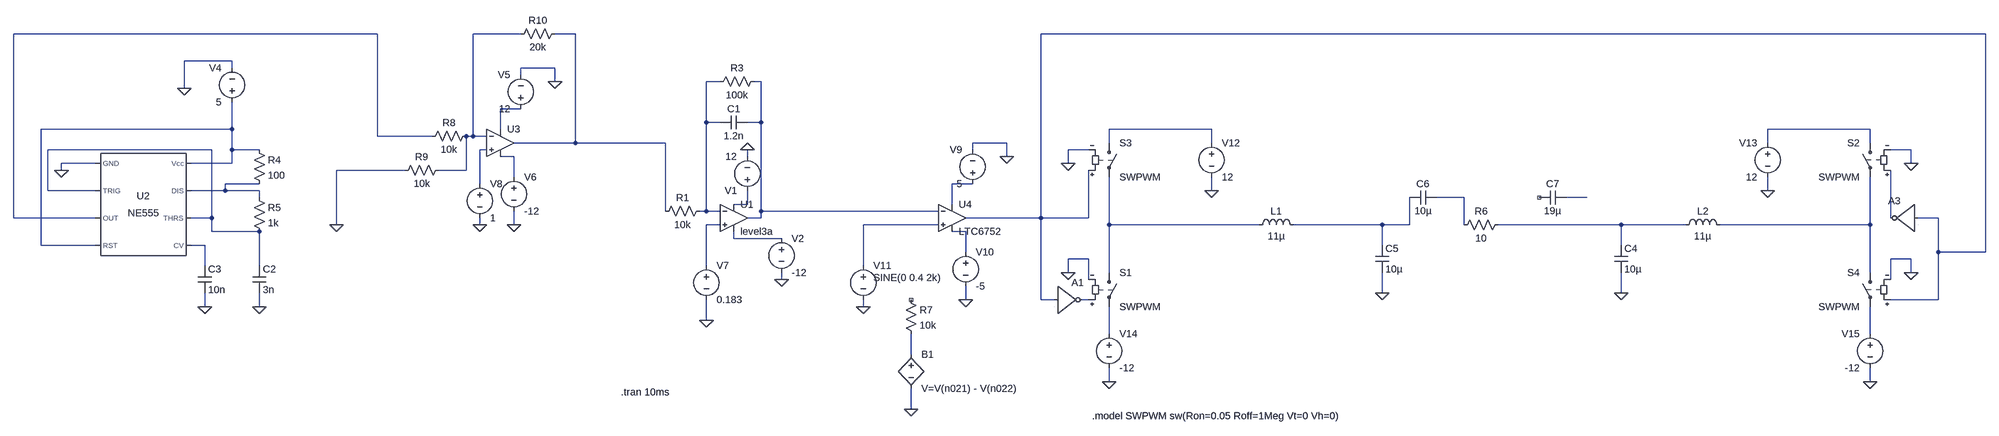
[diagram p0: schematic class_D_amp.asc]
class_D_amp.asc, the LTspice schematic file:
Version 4.1
SHEET 1 4280 724
WIRE -880 -256 -1936 -256
WIRE -544 -256 -656 -256
WIRE -416 -256 -464 -256
WIRE 3424 -256 1088 -256
WIRE -1424 -192 -1536 -192
WIRE -1424 -176 -1424 -192
WIRE -464 -176 -544 -176
WIRE -544 -160 -544 -176
WIRE -464 -144 -464 -176
WIRE 288 -144 256 -144
WIRE 384 -144 368 -144
WIRE -1536 -128 -1536 -192
WIRE -544 -80 -592 -80
WIRE 256 -48 256 -144
WIRE 288 -48 256 -48
WIRE 384 -48 384 -144
WIRE 384 -48 352 -48
WIRE -1424 -32 -1424 -96
WIRE -1424 -32 -1872 -32
WIRE -592 -32 -592 -80
WIRE 1488 -32 1248 -32
WIRE 3040 -32 2800 -32
WIRE -880 -16 -880 -256
WIRE -752 -16 -880 -16
WIRE -656 -16 -656 -256
WIRE -656 -16 -672 -16
WIRE -624 -16 -656 -16
WIRE -416 0 -416 -256
WIRE -416 0 -560 0
WIRE 160 0 -416 0
WIRE 1008 0 928 0
WIRE 1248 0 1248 -32
WIRE 1488 0 1488 -32
WIRE 2800 0 2800 -32
WIRE 3040 0 3040 -32
WIRE -1472 16 -1856 16
WIRE -1424 16 -1424 -32
WIRE -1360 16 -1424 16
WIRE -624 16 -640 16
WIRE 928 16 928 0
WIRE 1200 16 1152 16
WIRE 3136 16 3088 16
WIRE -560 32 -592 32
WIRE 352 32 352 16
WIRE 1008 32 1008 0
WIRE -1744 48 -1824 48
WIRE -1424 48 -1424 16
WIRE -1424 48 -1520 48
WIRE 1152 48 1152 16
WIRE 3136 48 3136 16
WIRE -1824 64 -1824 48
WIRE -816 64 -976 64
WIRE -672 64 -672 -16
WIRE -672 64 -736 64
WIRE -560 80 -560 32
WIRE -1360 96 -1440 96
WIRE -640 96 -640 16
WIRE 928 96 880 96
WIRE -1856 112 -1856 16
WIRE -1744 112 -1856 112
WIRE -1440 112 -1440 96
WIRE -1440 112 -1520 112
WIRE -1360 112 -1440 112
WIRE 1488 112 1488 80
WIRE 2800 112 2800 80
WIRE -1360 128 -1360 112
WIRE 2080 128 2016 128
WIRE 2368 128 2320 128
WIRE 352 144 352 112
WIRE 352 144 320 144
WIRE 880 144 880 96
WIRE 160 160 160 0
WIRE 256 160 256 -48
WIRE 256 160 240 160
WIRE 288 160 256 160
WIRE 384 160 384 -48
WIRE 848 160 384 160
WIRE -1936 176 -1936 -256
WIRE -1744 176 -1936 176
WIRE -1472 176 -1472 16
WIRE -1472 176 -1520 176
WIRE 384 176 384 160
WIRE 384 176 352 176
WIRE 1088 176 1088 -256
WIRE 1088 176 912 176
WIRE 1200 176 1200 64
WIRE 1200 176 1088 176
WIRE 3088 176 3088 64
WIRE 3200 176 3152 176
WIRE -976 192 -976 64
WIRE -640 192 -640 176
WIRE -560 192 -560 160
WIRE 288 192 256 192
WIRE 848 192 672 192
WIRE 1248 192 1248 80
WIRE 1600 192 1248 192
WIRE 1888 192 1680 192
WIRE 1952 192 1952 128
WIRE 1952 192 1888 192
WIRE 2080 192 2080 128
WIRE 2448 192 2160 192
WIRE 2608 192 2448 192
WIRE 3040 192 3040 80
WIRE 3040 192 2688 192
WIRE -1472 208 -1472 176
WIRE -1360 208 -1472 208
WIRE 912 208 880 208
WIRE 320 224 320 208
WIRE 432 224 320 224
WIRE -1872 240 -1872 -32
WIRE -1744 240 -1872 240
WIRE -1488 240 -1520 240
WIRE 1888 240 1888 192
WIRE 2448 240 2448 192
WIRE 912 256 912 208
WIRE 3200 256 3200 176
WIRE 3424 256 3424 -256
WIRE 3424 256 3200 256
WIRE 1200 272 1152 272
WIRE 3136 272 3088 272
WIRE -1488 288 -1488 240
WIRE -1360 288 -1360 208
WIRE 256 288 256 192
WIRE 672 288 672 192
WIRE 1152 304 1152 272
WIRE 1248 304 1248 192
WIRE 3040 304 3040 192
WIRE 3136 304 3136 272
WIRE 432 320 432 304
WIRE 1200 320 1200 272
WIRE 3088 320 3088 272
WIRE 1888 352 1888 304
WIRE 2448 352 2448 304
WIRE 912 368 912 336
WIRE 1088 368 1088 176
WIRE 1120 368 1088 368
WIRE 1200 368 1184 368
WIRE 3200 368 3200 256
WIRE 3200 368 3088 368
WIRE -1488 384 -1488 352
WIRE -1360 384 -1360 352
WIRE 672 384 672 368
WIRE 256 416 256 368
WIRE 1248 448 1248 384
WIRE 3040 448 3040 384
WIRE 784 496 784 448
WIRE 1248 560 1248 528
WIRE 3040 560 3040 528
WIRE 784 624 784 576
FLAG 352 16 0
FLAG 432 320 0
FLAG 256 416 0
FLAG -1536 -128 0
FLAG -1824 64 0
FLAG -1488 384 0
FLAG -1360 384 0
FLAG -560 192 0
FLAG -464 -144 0
FLAG -976 192 0
FLAG -640 192 0
FLAG 912 368 0
FLAG 1008 32 0
FLAG 672 384 0
FLAG 1152 48 0
FLAG 1152 304 0
FLAG 1248 560 0
FLAG 1488 112 0
FLAG 3136 48 0
FLAG 3136 304 0
FLAG 3040 560 0
FLAG 2800 112 0
FLAG 784 624 0
FLAG 1888 352 0
FLAG 2448 352 0
SYMBOL OpAmps\\UniversalOpAmp3 320 176 R0
SYMATTR InstName U1
SYMBOL voltage 352 128 R180
WINDOW 123 0 0 Left 0
WINDOW 39 0 0 Left 0
SYMATTR InstName V1
SYMATTR Value 12
SYMBOL voltage 432 208 R0
WINDOW 123 0 0 Left 0
WINDOW 39 0 0 Left 0
SYMATTR InstName V2
SYMATTR Value -12
SYMBOL res 256 144 R90
WINDOW 0 0 56 VBottom 2
WINDOW 3 32 56 VTop 2
SYMATTR InstName R1
SYMATTR Value 10k
SYMBOL cap 352 -64 R90
WINDOW 0 0 32 VBottom 2
WINDOW 3 32 32 VTop 2
SYMATTR InstName C1
SYMATTR Value 1.2n
SYMBOL res 384 -160 R90
WINDOW 0 0 56 VBottom 2
WINDOW 3 32 56 VTop 2
SYMATTR InstName R3
SYMATTR Value 100k
SYMBOL Misc\\NE555 -1632 144 R0
SYMATTR InstName U2
SYMBOL voltage -1424 -80 R180
WINDOW 0 24 96 Left 2
WINDOW 3 24 16 Left 2
WINDOW 123 0 0 Left 0
WINDOW 39 0 0 Left 0
SYMATTR InstName V4
SYMATTR Value 5
SYMBOL res -1376 0 R0
SYMATTR InstName R4
SYMATTR Value 100
SYMBOL res -1376 112 R0
SYMATTR InstName R5
SYMATTR Value 1k
SYMBOL cap -1376 288 R0
SYMATTR InstName C2
SYMATTR Value 3n
SYMBOL cap -1504 288 R0
SYMATTR InstName C3
SYMATTR Value 10n
SYMBOL res -448 -272 R90
WINDOW 0 0 56 VBottom 2
WINDOW 3 32 56 VTop 2
SYMATTR InstName R10
SYMATTR Value 20k
SYMBOL voltage -544 -64 R180
WINDOW 0 24 96 Left 2
WINDOW 3 24 16 Left 2
WINDOW 123 0 0 Left 0
WINDOW 39 0 0 Left 0
SYMATTR InstName V5
SYMATTR Value 12
SYMBOL voltage -560 64 R0
WINDOW 123 0 0 Left 0
WINDOW 39 0 0 Left 0
SYMATTR InstName V6
SYMATTR Value -12
SYMBOL res -656 -32 R90
WINDOW 0 0 56 VBottom 2
WINDOW 3 32 56 VTop 2
SYMATTR InstName R8
SYMATTR Value 10k
SYMBOL res -720 48 R90
WINDOW 0 0 56 VBottom 2
WINDOW 3 32 56 VTop 2
SYMATTR InstName R9
SYMATTR Value 10k
SYMBOL voltage -640 80 R0
WINDOW 123 0 0 Left 0
WINDOW 39 0 0 Left 0
SYMATTR InstName V8
SYMATTR Value 1
SYMBOL OpAmps\\UniversalOpAmp -592 0 R0
SYMATTR InstName U3
SYMBOL voltage 256 272 R0
WINDOW 123 0 0 Left 0
WINDOW 39 0 0 Left 0
SYMATTR InstName V7
SYMATTR Value 0.183
SYMBOL voltage 928 112 R180
WINDOW 0 24 96 Left 2
WINDOW 3 24 16 Left 2
WINDOW 123 0 0 Left 0
WINDOW 39 0 0 Left 0
SYMATTR InstName V9
SYMATTR Value 5
SYMBOL voltage 912 240 R0
WINDOW 123 0 0 Left 0
WINDOW 39 0 0 Left 0
SYMATTR InstName V10
SYMATTR Value -5
SYMBOL voltage 672 272 R0
WINDOW 123 0 0 Left 0
WINDOW 39 0 0 Left 0
WINDOW 3 24 44 Left 2
SYMATTR Value SINE(0 0.4 2k)
SYMATTR InstName V11
SYMBOL Comparators\\LTC6752 880 112 R0
SYMATTR InstName U4
SYMBOL sw 1248 -16 R0
SYMATTR InstName S3
SYMATTR Value SWPWM
SYMBOL sw 1248 288 R0
SYMATTR InstName S1
SYMATTR Value SWPWM
SYMBOL Digital\\inv 1120 304 R0
SYMATTR InstName A1
SYMBOL voltage 1488 -16 R0
WINDOW 123 0 0 Left 0
WINDOW 39 0 0 Left 0
SYMATTR InstName V12
SYMATTR Value 12
SYMBOL voltage 1248 432 R0
WINDOW 123 0 0 Left 0
WINDOW 39 0 0 Left 0
SYMATTR InstName V14
SYMATTR Value -12
SYMBOL ind 1584 208 R270
WINDOW 0 32 56 VTop 2
WINDOW 3 5 56 VBottom 2
SYMATTR InstName L1
SYMATTR Value 11µ
SYMATTR SpiceLine Rser=1m
SYMBOL sw 3040 -16 M0
SYMATTR InstName S2
SYMATTR Value SWPWM
SYMBOL sw 3040 288 M0
SYMATTR InstName S4
SYMATTR Value SWPWM
SYMBOL voltage 2800 -16 M0
WINDOW 123 0 0 Left 0
WINDOW 39 0 0 Left 0
SYMATTR InstName V13
SYMATTR Value 12
SYMBOL voltage 3040 432 M0
WINDOW 123 0 0 Left 0
WINDOW 39 0 0 Left 0
SYMATTR InstName V15
SYMATTR Value -12
SYMBOL ind 2704 208 M270
WINDOW 0 32 56 VTop 2
WINDOW 3 5 56 VBottom 2
SYMATTR InstName L2
SYMATTR Value 11µ
SYMATTR SpiceLine Rser=1m
SYMBOL Digital\\inv 3152 112 M0
SYMATTR InstName A3
SYMBOL bv 784 480 R0
SYMATTR InstName B1
SYMATTR Value V=V(n021) - V(n022)
SYMBOL res 768 352 R0
SYMATTR InstName R7
SYMATTR Value 10k
SYMBOL res 2176 176 R90
WINDOW 0 0 56 VBottom 2
WINDOW 3 32 56 VTop 2
SYMATTR InstName R6
SYMATTR Value 10
SYMBOL cap 2432 240 R0
SYMATTR InstName C4
SYMATTR Value 10µ
SYMBOL cap 1872 240 R0
SYMATTR InstName C5
SYMATTR Value 10µ
SYMBOL cap 2016 112 R90
WINDOW 0 0 32 VBottom 2
WINDOW 3 32 32 VTop 2
SYMATTR InstName C6
SYMATTR Value 10µ
SYMBOL cap 2320 112 R90
WINDOW 0 0 32 VBottom 2
WINDOW 3 32 32 VTop 2
SYMATTR InstName C7
SYMATTR Value 19µ
TEXT 56 584 Left 2 !.tran 10ms
TEXT 1208 640 Left 2 !.model SWPWM sw(Ron=0.05 Roff=1Meg Vt=0 Vh=0)

The netlist it stands for:
* class_D_amp.asc
X§U1 N020 N005 N018 N027 N006 level3a  ; pins In+ In- V+ V- OUT
V1 N018 0 12
V2 N027 0 -12
R1 N005 N003 10k
C1 N006 N005 1.2n
R3 N006 N005 100k
X§U2 0 N011 N001 N008 N028 N011 N014 N008 NE555  ; pins GND TRIG OUT RST CV THRS DIS Vcc
V4 N008 0 5
R4 N008 N014 100
R5 N014 N011 1k
C2 N011 0 3n
C3 N028 0 10n
R10 N003 N002 20k
V5 N007 0 12
V6 N013 0 -12
R8 N002 N001 10k
R9 N002 0 10k
V8 N012 0 1
X§U3 N012 N002 N007 N013 N003 level1 Avol=1Meg GBW=10Meg Vos=0 En=0 Enk=0 In=0 Ink=0 Rin=500Meg  ; pins In+ In- V+ V- OUT
V7 N020 0 0.183
V9 N015 0 5
V10 N026 0 -5
V11 N021 0 SINE(0 0.4 2k)
X§U4 N021 N006 N015 N026 N004 LTC6752  ; pins In+ In- V+ V- OUT
S3 N009 N022 N004 0 SWPWM
S1 N022 N030 N029 0 SWPWM
A1 N004 0 0 0 0 N029 0 0 BUF
V12 N009 0 12
V14 N030 0 -12
L1 N022 N023 11µ Rser=1m
S2 N010 N025 N019 0 SWPWM
S4 N025 N031 N004 0 SWPWM
V13 N010 0 12
V15 N031 0 -12
L2 N025 N024 11µ Rser=1m
A3 N004 0 0 0 0 N019 0 0 BUF
B1 N032 0 V=V(n021) - V(n022)
R7 NC_01 N032 10k
R6 N024 N016 10
C4 N024 0 10µ
C5 N023 0 10µ
C6 N016 N023 10µ
C7 N017 NC_02 19µ
.tran 10ms
.model SWPWM sw(Ron=0.05 Roff=1Meg Vt=0 Vh=0)
.lib NE555.sub
.lib UniversalOpAmp1.lib
.lib LTC7.lib
.backanno
.end